# Altium schematic sheet MicroSD SPI Interface.SchDoc: EMIF06 SDIO Interface
size Letter; SheetNumber: 5; SheetTotal: 11
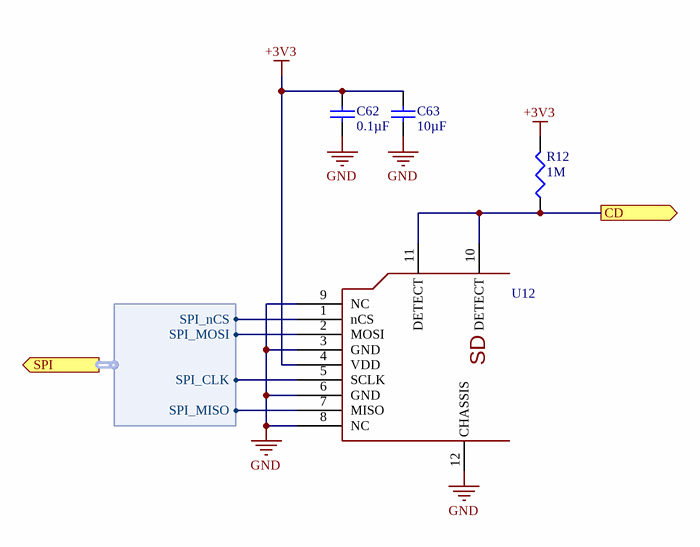
[diagram p0: MicroSD SPI Interface.SchDoc]

## Parts
C62  value 0.1µF  [TDK-CGA2B]  (hidden comment: Cap)
C63  value 10µF  [TDK-CGA5L]  (hidden comment: Cap)
R12  value 1M  [PANA-ERJ6EN]  (hidden comment: Res3)
U12  693063010911  [WL-693063010911]  (value not drawn)

## Ports
CD (out), SPI (out, harness MicroSD_SPI)

## Harnesses
MicroSD_SPI: SPI_CLK, SPI_nCS, SPI_MOSI, SPI_MISO

## Nets
+3V3: C62.1 C63.1 R12.2 U12.4(VDD)
GND: C62.2 C63.2 U12.3(GND) U12.6(GND) U12.8(NC) U12.9(NC) U12.12(CHASSIS)
CD: R12.1 U12.10(DETECT) U12.11(DETECT) ; port CD
NetU12_1: U12.1(nCS) ; port SPI.SPI_nCS
NetU12_2: U12.2(MOSI) ; port SPI.SPI_MOSI
NetU12_5: U12.5(SCLK) ; port SPI.SPI_CLK
NetU12_7: U12.7(MISO) ; port SPI.SPI_MISO

## Notes on the sheet
- (the "License"); you may not use or redistribute this file except in compliance with the License. You
- This file and the information within it are licensed under the terms of the Apache License, Version 2.0
- Copyright
- Unless required by applicable law or agreed to in writing, content distributed under the License is
- distributed on an "AS IS" BASIS, WITHOUT WARRANTIES OR CONDITIONS OF ANY KIND,
- either express or implied. See the License for the specific language governing permissions and
- limitations under the License.
- may obtain a copy of the License at:
- http://www.apache.org/licenses/LICENSE-2.0
- Title
- Size:
- Date:
- Letter
- Number:
- Time:
- Revision:
- Sheet
- of
- University of Alberta
- Deptartment of Electrical
- and Computer Engineering
- Edmonton AB, Canada
- T6G 1H9
- File:
- (in symbol 56) SD

## Library data of the parts
C62 = PC-TDK-02259: CAP CER 0.1UF 50V X7R 0402; Manufacturer Part Number: CGA2B3X7R1H104K050BB; Index: 2259; Designator: C?; Tolerance: ±10%; Published: 2016-03-16; LatestRevisionDate: 2016-03-16; LatestRevisionNote: ...; PackageReference: 0402 (1005 Metric); Publisher: AlbertaSat; PackageDescription: Radial Cap, Thru-Hole; 2 Leads; 0.3 in Pin Spacing; Part Number: PC-TDK-02259; Supplier Part Number 1: 445-6899-1-ND; Supplier 1: Digi-key; Supplier Link: http://www.digikey.ca/product-search/en?keywords=445-6899-1-ND; Voltage - Rated: 50V; Temperature Coefficient: X7R; Applications: Automotive
C63 = PC-TDK-02917: CAP CER 10UF 25V X7R 1206; Manufacturer Part Number: CGA5L1X7R1E106K160AC; Index: 2917; Tolerance: ±10%; Published: 3/16/2016; LatestRevisionDate: 3/16/2016; LatestRevisionNote: ...; PackageReference: 1206 (3216 Metric); Publisher: AlbertaSat; PackageDescription: Radial Cap, Thru-Hole; 2 Leads; 0.3 in Pin Spacing; Part Number: PC-TDK-02917; Supplier Part Number 1: 445-6990-1-ND; Supplier 1: Digi-key; Supplier Link: http://www.digikey.ca/product-search/en?keywords=445-6990-1-ND; Voltage - Rated: 25V; Temperature Coefficient: X7R; Applications: Automotive
R12 = 19707: RES SMD 1M OHM 1% 1/8W 0805; Part Number: 19707; Manufacturer Part Number: ERJ-6ENF1004V; Power: 0.125W, 1/8W; Temperature Coefficient: ±100ppm/°C; Published: 8-Jun-2000; LatestRevisionDate: 29-May-2009; LatestRevisionNote: IPC-7351 Footprint Added.; PackageReference: 0805 (2012 Metric); Publisher: Altium Limited; PackageDescription: Chip Resistor, 2-Leads, Body 2.00x1.25mm, IPC Low Density; Supplier Part Number 1: P1.00MCCT-ND; Supplier 1: Digi-Key; Supplier Link: http://www.digikey.ca/product-search/en?keywords=P1.00MCCT-ND; Tolerance: ±1%
U12 = 56: CONN SD CARD PUSH-PULL R/A SMD; Part Number: 56; Designator: U?; Manufacturer Part Number: 693063010911; Supplier Part Number 1: 732-3817-1-ND; Supplier 1: Digi-Key; Supplier Part Number 2: 710-693063010911; Supplier 2: Mouser; Supplier Link: #https://www.digikey.ca/product-detail/en/wurth-electronics-inc/693063010911/732-3817-1-ND/3124599#